# EAGLE schematic 504_outin_chirimen (EAGLE 7.4.0)
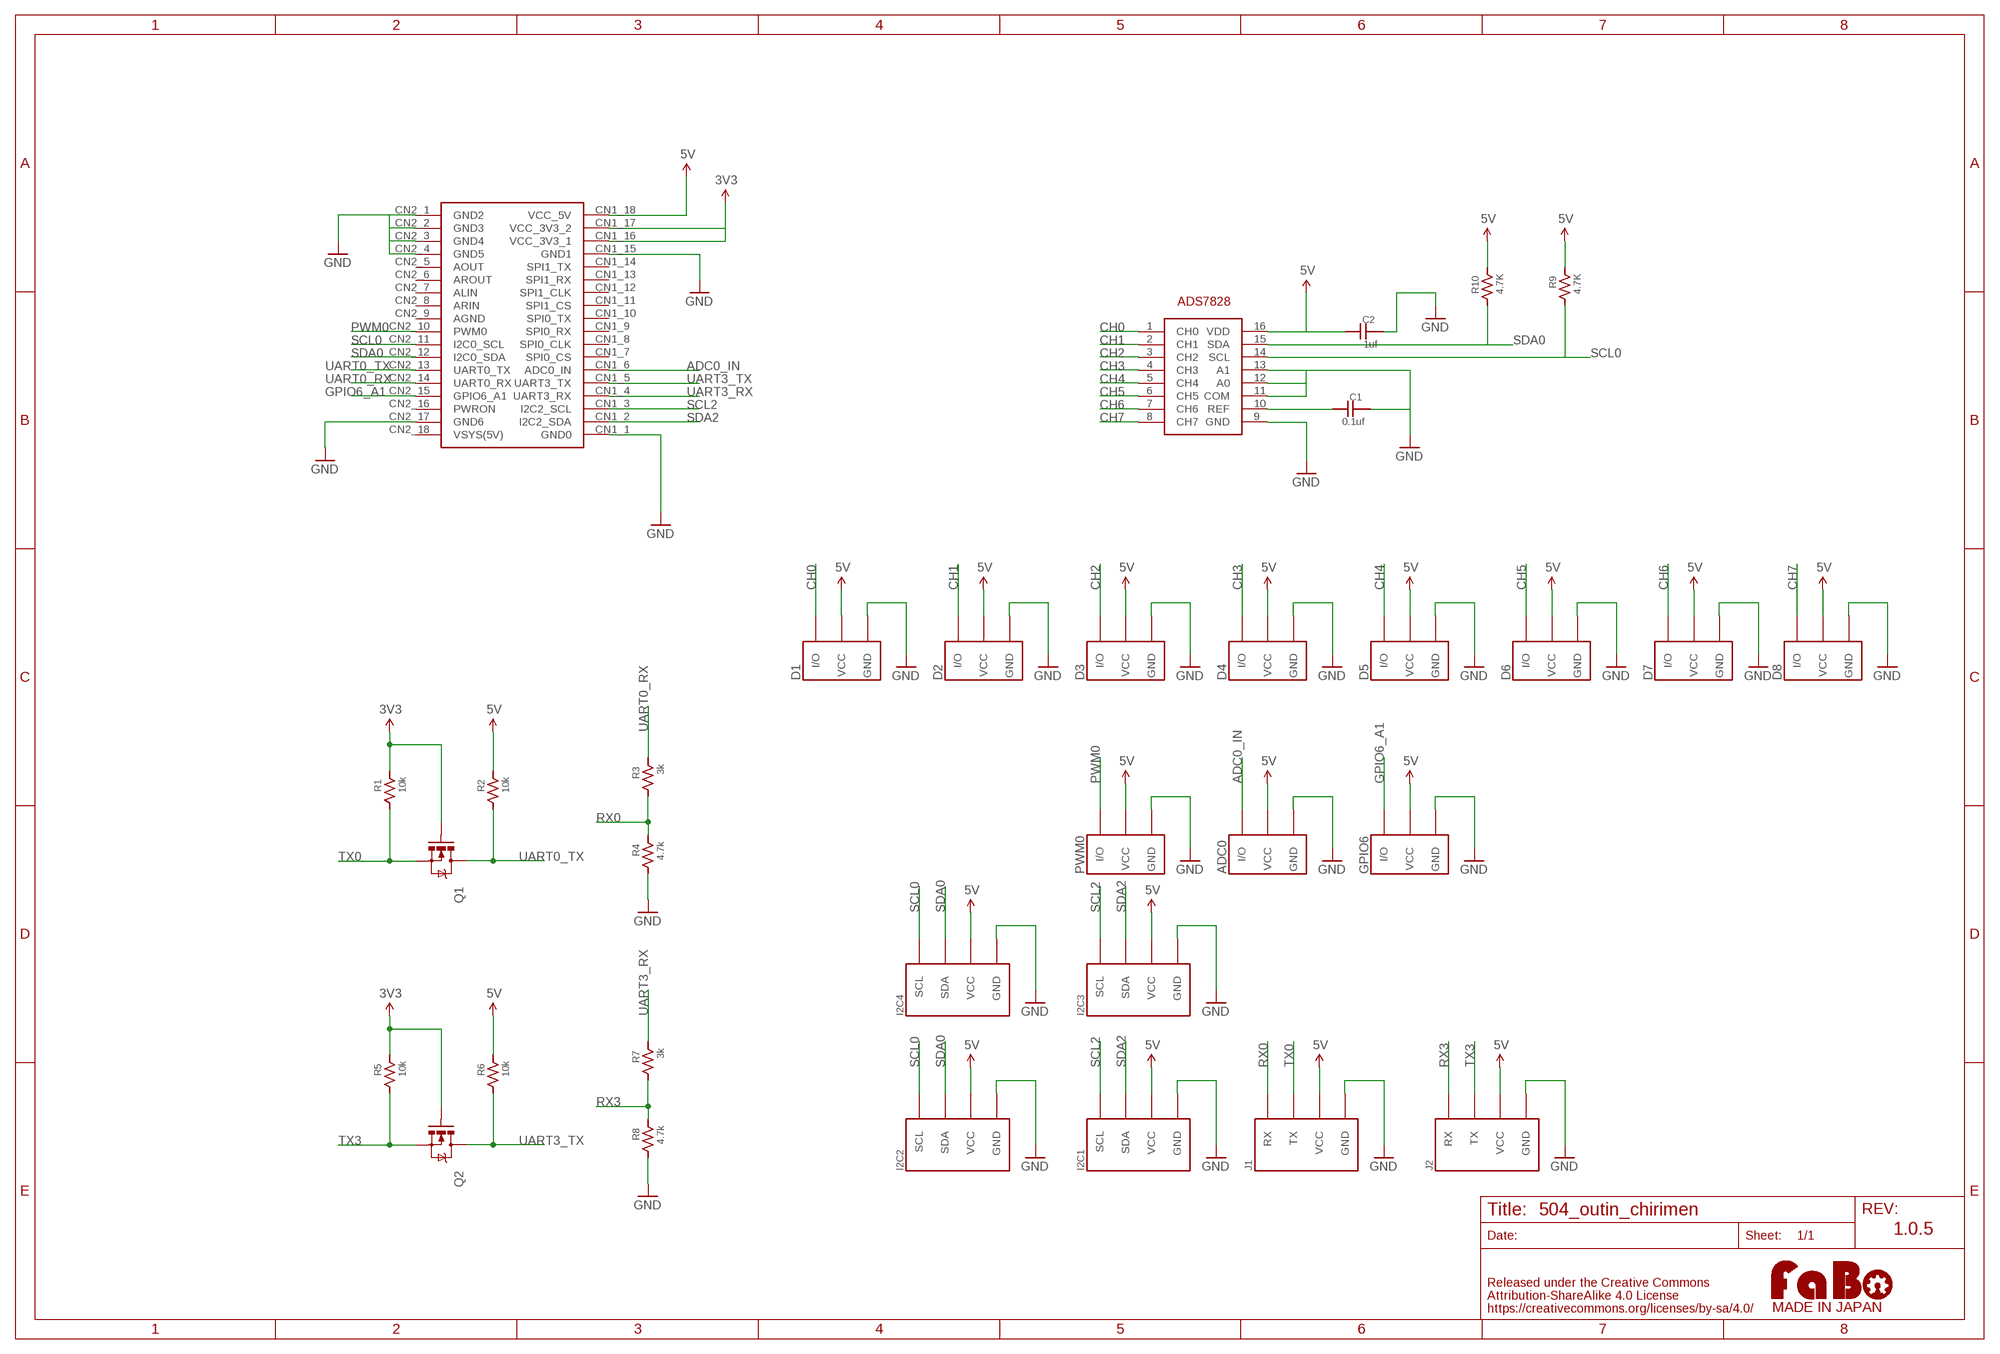
[diagram p0: schematic, sheet 1]

## Parts
ADC0  FABO_BRICK_3PIN-HEADER  [FABO_BRICK_3PIN_HEADER]
C1  0.1uf  CAPACITOR0402  [0402]
C2  1uf  CAPACITOR0402  [0402]
D1  FABO_BRICK_3PIN-B03B-PASK-1_SILK  [FABO_BRICK_3PIN_B03B-PASK-1_SILK]
D2  FABO_BRICK_3PIN-B03B-PASK-1_SILK  [FABO_BRICK_3PIN_B03B-PASK-1_SILK]
D3  FABO_BRICK_3PIN-B03B-PASK-1_SILK  [FABO_BRICK_3PIN_B03B-PASK-1_SILK]
D4  FABO_BRICK_3PIN-B03B-PASK-1_SILK  [FABO_BRICK_3PIN_B03B-PASK-1_SILK]
D5  FABO_BRICK_3PIN-B03B-PASK-1_SILK  [FABO_BRICK_3PIN_B03B-PASK-1_SILK]
D6  FABO_BRICK_3PIN-B03B-PASK-1_SILK  [FABO_BRICK_3PIN_B03B-PASK-1_SILK]
D7  FABO_BRICK_3PIN-B03B-PASK-1_SILK  [FABO_BRICK_3PIN_B03B-PASK-1_SILK]
D8  FABO_BRICK_3PIN-B03B-PASK-1_SILK  [FABO_BRICK_3PIN_B03B-PASK-1_SILK]
GPIO6  FABO_BRICK_3PIN-HEADER  [FABO_BRICK_3PIN_HEADER]
I2C1  FABO_BRICK_I2C-B04B-PASK-1_SILK  [FABO_BRICK_I2C_B04B-PASK-1_SILK]
I2C2  FABO_BRICK_I2C-B04B-PASK-1_SILK  [FABO_BRICK_I2C_B04B-PASK-1_SILK]
I2C3  FABO_BRICK_I2C-B04B-PASK-1_SILK  [FABO_BRICK_I2C_B04B-PASK-1_SILK]
I2C4  FABO_BRICK_I2C-B04B-PASK-1_SILK  [FABO_BRICK_I2C_B04B-PASK-1_SILK]
IC  TI-ADS7828  [TI-ADS7828]
J1  FABO_BRICK_SERIAL-S04B-PASK-2_SILK  [FABO_BRICK_SERIAL_S04B-PASK-2_SILK]
J2  FABO_BRICK_SERIAL-S04B-PASK-2_SILK  [FABO_BRICK_SERIAL_S04B-PASK-2_SILK]
PWM0  FABO_BRICK_3PIN-HEADER  [FABO_BRICK_3PIN_HEADER]
Q1  MOSFET-N-BSS138  [SOT23-3]
Q2  MOSFET-N-BSS138  [SOT23-3]
R1  10k  RESISTOR-0402  [0402]
R2  10k  RESISTOR-0402  [0402]
R3  3k  RESISTOR-0402  [0402]
R4  4.7k  RESISTOR-0402  [0402]
R5  10k  RESISTOR-0402  [0402]
R6  10k  RESISTOR-0402  [0402]
R7  3k  RESISTOR-0402  [0402]
R8  4.7k  RESISTOR-0402  [0402]
R9  4.7K  RESISTOR-0402  [0402]
R10  4.7K  RESISTOR-0402  [0402]
U$2  FABO-CHIRIMEN  [FABO-CHIRIMEN]
U$10  LOGO_FABO-M  [LOGO_FABO_MS]

## Nets
3V3: Q1.1(G) Q2.1(G) R1.P$2 R5.P$2 U$2.CN1_16(VCC_3V3_1) U$2.CN1_17(VCC_3V3_2)
5V: ADC0.VCC C2.P$1 D1.VCC D2.VCC D3.VCC D4.VCC D5.VCC D6.VCC D7.VCC D8.VCC GPIO6.VCC I2C1.VCC I2C2.VCC I2C3.VCC I2C4.VCC IC.16(VDD) J1.VCC J2.VCC PWM0.VCC R2.P$2 R6.P$2 R9.P$2 R10.P$2 U$2.CN1_18(VCC_5V)
ADC0_IN: ADC0.I/O U$2.CN1_6(ADC0_IN)
CH0: D1.I/O IC.1(CH0)
CH1: D2.I/O IC.2(CH1)
CH2: D3.I/O IC.3(CH2)
CH3: D4.I/O IC.4(CH3)
CH4: D5.I/O IC.5(CH4)
CH5: D6.I/O IC.6(CH5)
CH6: D7.I/O IC.7(CH6)
CH7: D8.I/O IC.8(CH7)
GND: ADC0.GND C1.P$2 C2.P$2 D1.GND D2.GND D3.GND D4.GND D5.GND D6.GND D7.GND D8.GND GPIO6.GND I2C1.GND I2C2.GND I2C3.GND I2C4.GND IC.9(GND) IC.11(COM) IC.12(A0) IC.13(A1) J1.GND J2.GND PWM0.GND R4.P$1 R8.P$1 U$2.CN1_1(GND0) U$2.CN1_15(GND1) U$2.CN2_1(GND2) U$2.CN2_2(GND3) U$2.CN2_3(GND4) U$2.CN2_4(GND5) U$2.CN2_17(GND6)
GPIO6_A1: GPIO6.I/O U$2.CN2_15(GPIO6_A1)
N$3: C1.P$1 IC.10(REF)
PWM0: PWM0.I/O U$2.CN2_10(PWM0)
RX0: J1.RX R3.P$1 R4.P$2
RX3: J2.RX R7.P$1 R8.P$2
SCL0: I2C2.SCL I2C4.SCL IC.14(SCL) R9.P$1 U$2.CN2_11(I2C0_SCL)
SCL2: I2C1.SCL I2C3.SCL U$2.CN1_3(I2C2_SCL)
SDA0: I2C2.SDA I2C4.SDA IC.15(SDA) R10.P$1 U$2.CN2_12(I2C0_SDA)
SDA2: I2C1.SDA I2C3.SDA U$2.CN1_2(I2C2_SDA)
TX0: J1.TX Q1.2(S) R1.P$1
TX3: J2.TX Q2.2(S) R5.P$1
UART0_RX: R3.P$2 U$2.CN2_14(UART0_RX)
UART0_TX: Q1.3(D) R2.P$1 U$2.CN2_13(UART0_TX)
UART3_RX: R7.P$2 U$2.CN1_4(UART3_RX)
UART3_TX: Q2.3(D) R6.P$1 U$2.CN1_5(UART3_TX)
Unconnected: U$2.CN1_7(SPI0_CS) U$2.CN1_8(SPI0_CLK) U$2.CN1_9(SPI0_RX) U$2.CN1_10(SPI0_TX) U$2.CN1_11(SPI1_CS) U$2.CN1_12(SPI1_CLK) U$2.CN1_13(SPI1_RX) U$2.CN1_14(SPI1_TX) U$2.CN2_5(AOUT) U$2.CN2_6(AROUT) U$2.CN2_7(ALIN) U$2.CN2_8(ARIN) U$2.CN2_9(AGND) U$2.CN2_16(PWRON) U$2.CN2_18(VSYS(5V))

## Notes on the sheet
- 1.0.5

## Library data of the parts
ADC0 D1-D8 GPIO6 PWM0 = FaBo-Template:FABO_BRICK_3PIN: FaBo Brick 3pin
C1 C2 = FaBo-Capacitor:CAPACITOR: CAPACITOR
I2C1-I2C4 = FaBo-Template:FABO_BRICK_I2C: FaBo Brick I2C
IC = FaBo-ADC:TI-ADS7828
J1 J2 = FaBo-Template:FABO_BRICK_SERIAL: FaBo Brick Serial
Q1 Q2 = FaBo-etc:MOSFET-N
R1-R10 = FaBo-Resistors:RESISTOR: RESISTOR
U$2 = FaBo-Template:FABO-CHIRIMEN
U$10 = FaBo-etc:LOGO_FABO